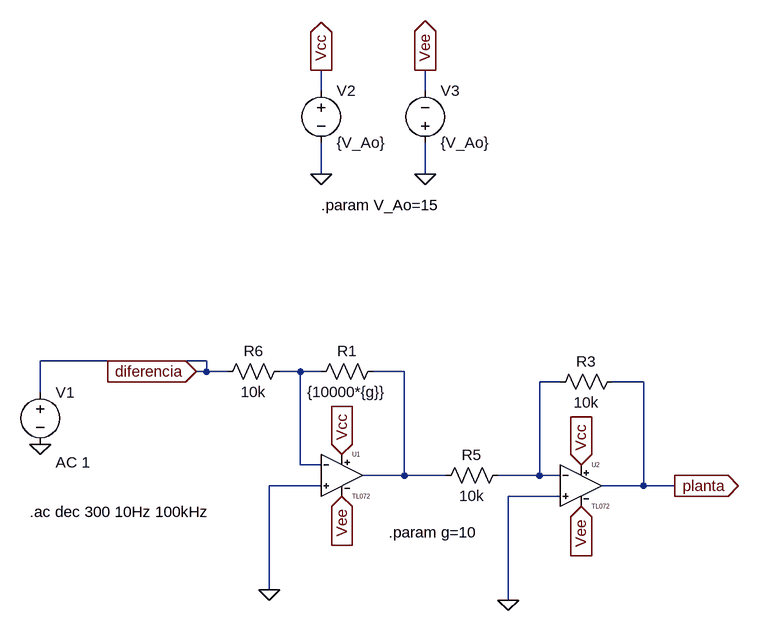
[diagram p0: schematic bloque_ganancia.asc]
bloque_ganancia.asc, the LTspice schematic file:
Version 4
SHEET 1 880 680
WIRE 32 -416 32 -448
WIRE 192 -416 192 -448
WIRE 32 -288 32 -336
WIRE 192 -288 192 -336
WIRE -144 0 -400 0
WIRE -144 16 -144 0
WIRE -144 16 -160 16
WIRE -112 16 -144 16
WIRE 0 16 -32 16
WIRE 32 16 0 16
WIRE 160 16 112 16
WIRE 400 32 368 32
WIRE 528 32 480 32
WIRE -400 48 -400 0
WIRE 0 160 0 16
WIRE 32 160 0 160
WIRE 160 176 160 16
WIRE 160 176 96 176
WIRE 224 176 160 176
WIRE 368 176 368 32
WIRE 368 176 304 176
WIRE 400 176 368 176
WIRE 32 192 -48 192
WIRE 528 192 528 32
WIRE 528 192 464 192
WIRE 576 192 528 192
WIRE 400 208 320 208
WIRE -48 352 -48 192
WIRE 320 368 320 208
FLAG 64 144 Vcc
IOPIN 64 144 In
FLAG 64 208 Vee
IOPIN 64 208 In
FLAG -48 352 0
FLAG 432 160 Vcc
IOPIN 432 160 In
FLAG 432 224 Vee
IOPIN 432 224 In
FLAG 320 368 0
FLAG -160 16 diferencia
IOPIN -160 16 In
FLAG 576 192 planta
IOPIN 576 192 Out
FLAG -400 128 0
FLAG 32 -288 0
FLAG 192 -288 0
FLAG 192 -448 Vee
IOPIN 192 -448 Out
FLAG 32 -448 Vcc
IOPIN 32 -448 Out
SYMBOL res 128 0 R90
WINDOW 0 0 56 VBottom 2
WINDOW 3 32 56 VTop 2
SYMATTR InstName R1
SYMATTR Value {10000*{g}}
SYMBOL res 496 16 R90
WINDOW 0 0 56 VBottom 2
WINDOW 3 32 56 VTop 2
SYMATTR InstName R3
SYMATTR Value 10k
SYMBOL res 320 160 R90
WINDOW 0 0 56 VBottom 2
WINDOW 3 32 56 VTop 2
SYMATTR InstName R5
SYMATTR Value 10k
SYMBOL res -16 0 R90
WINDOW 0 0 56 VBottom 2
WINDOW 3 32 56 VTop 2
SYMATTR InstName R6
SYMATTR Value 10k
SYMBOL voltage -400 32 R0
WINDOW 123 24 124 Left 2
WINDOW 39 0 0 Left 0
SYMATTR InstName V1
SYMATTR Value ""
SYMATTR Value2 AC 1
SYMBOL voltage 32 -432 R0
SYMATTR InstName V2
SYMATTR Value {V_Ao}
SYMBOL voltage 192 -320 M180
WINDOW 0 24 96 Left 2
WINDOW 3 24 16 Left 2
SYMATTR InstName V3
SYMATTR Value {V_Ao}
SYMBOL Opamps\\TL072 64 112 R0
SYMATTR InstName U1
SYMBOL Opamps\\TL072 432 128 R0
SYMATTR InstName U2
TEXT 136 264 Left 2 !.param g=10
TEXT -416 232 Left 2 !.ac dec 300 10Hz 100kHz
TEXT 32 -240 Left 2 !.param V_Ao=15

The netlist it stands for:
* bloque_ganancia.asc
R1 N002 N001 {10000*{g}}
R3 planta N003 10k
R5 N003 N002 10k
R6 N001 diferencia 10k
V1 diferencia 0 AC 1
V2 Vcc 0 {V_Ao}
V3 0 Vee {V_Ao}
XU1 0 N001 Vcc Vee N002 TL072  ; pins In+ In- V+ V- OUT
XU2 0 N003 Vcc Vee planta TL072  ; pins In+ In- V+ V- OUT
.param g=10
.ac dec 300 10Hz 100kHz
.param V_Ao=15
.lib TL072.sub
.backanno
.end